# EAGLE schematic TNP Schematic (EAGLE 7.6.0)
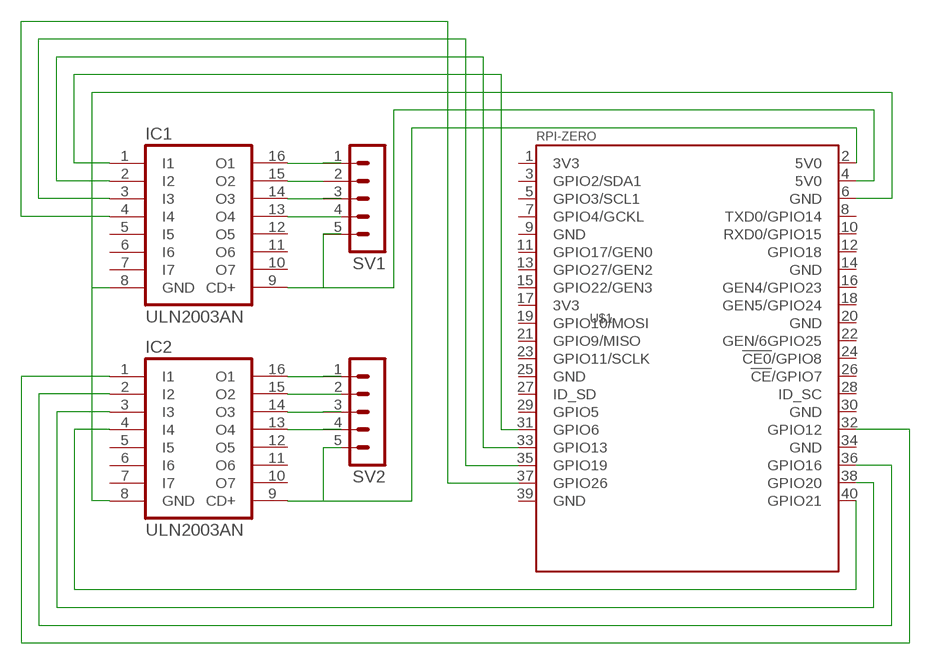
[diagram p0: schematic, sheet 1]

## Parts
IC1  ULN2003AN  [DIL16]
IC2  ULN2003AN  [DIL16]
SV1  MA05-1  [MA05-1]
SV2  MA05-1  [MA05-1]
U$1  RPI-ZERO  [RASPBERRYPI_BASTELSTUBE_V13_RASPI_BOARD_B+_FULL]

## Nets
5V0@1: IC2.9(CD+) SV2.5 U$1.2(5V0)
5V0@2: IC1.9(CD+) U$1.4(5V0)
GND@8: IC1.8(GND) IC2.8(GND) U$1.6(GND)
N$1: IC1.16(O1) SV1.1
N$2: IC1.15(O2) SV1.2
N$3: IC1.14(O3) SV1.3
N$4: IC1.13(O4) SV1.4
N$5: IC2.16(O1) SV2.1
N$6: IC2.15(O2) SV2.2
N$7: IC2.14(O3) SV2.3
N$8: IC2.13(O4) SV2.4
N$9: IC2.4(I4) U$1.40(GPIO21)
N$10: IC2.3(I3) U$1.38(GPIO20)
N$11: IC2.2(I2) U$1.36(GPIO16)
N$12: IC1.1(I1) U$1.31(GPIO6)
N$13: IC1.2(I2) U$1.33(GPIO13)
N$14: IC1.3(I3) U$1.35(GPIO19)
N$15: IC1.4(I4) U$1.37(GPIO26)
N$17: IC2.1(I1) U$1.32(GPIO12)
Unconnected: IC1.5(I5) IC1.6(I6) IC1.7(I7) IC1.10(O7) IC1.11(O6) IC1.12(O5) IC2.5(I5) IC2.6(I6) IC2.7(I7) IC2.10(O7) IC2.11(O6) IC2.12(O5) SV1.5 U$1.1(3V3) U$1.3(GPIO2/SDA1) U$1.5(GPIO3/SCL1) U$1.7(GPIO4/GCKL) U$1.8(TXD0/GPIO14) U$1.9(GND) U$1.10(RXD0/GPIO15) U$1.11(GPIO17/GEN0) U$1.12(GPIO18) U$1.13(GPIO27/GEN2) U$1.14(GND) U$1.15(GPIO22/GEN3) U$1.16(GEN4/GPIO23) U$1.17(3V3) U$1.18(GEN5/GPIO24) U$1.19(GPIO10/MOSI) U$1.20(GND) U$1.21(GPIO9/MISO) U$1.22(GEN/6GPIO25) U$1.23(GPIO11/SCLK) U$1.24(!CE0!/GPIO8) U$1.25(GND) U$1.26(!CE!/GPIO7) U$1.27(ID_SD) U$1.28(ID_SC) U$1.29(GPIO5) U$1.30(GND) U$1.34(GND) U$1.39(GND)

## Library data of the parts
IC1 IC2 = uln-udn:ULN2003A: DRIVER ARRAY
SV1 SV2 = con-lstb:MA05-1: PIN HEADER; OC_FARNELL: unknown; OC_NEWARK: unknown
U$1 = RPI-Zero:RPI-ZERO